# Altium schematic sheet Adapter.SchDoc
size B
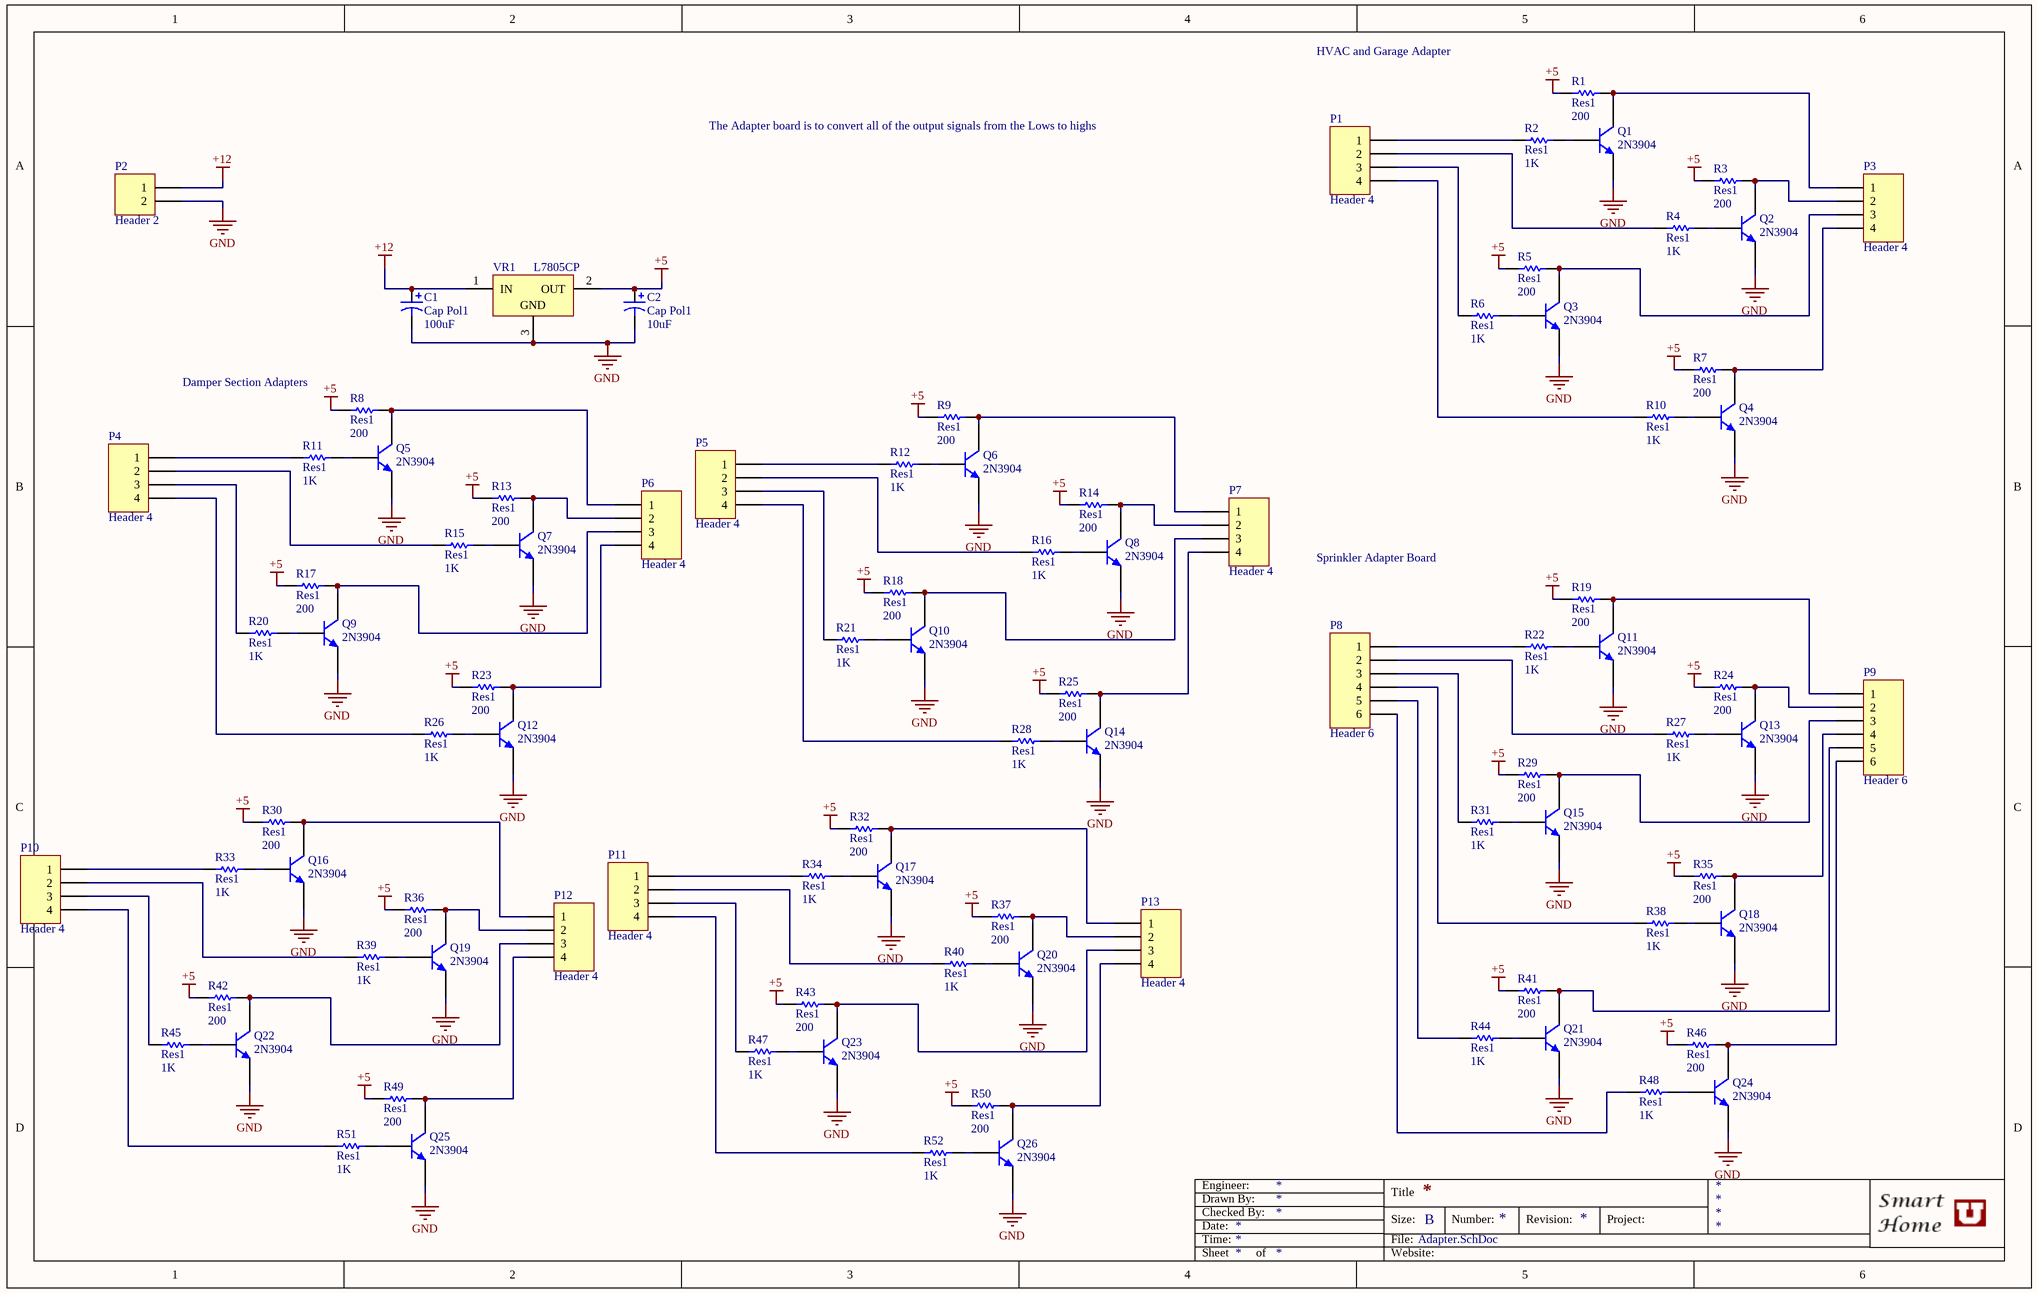
[diagram p0: Adapter.SchDoc]

## Parts
C1  Cap Pol1  value 100uF  [RB7.6-15]
C2  Cap Pol1  value 10uF  [RB7.6-15]
P1  Header 4  [HDR1X4]
P2  Header 2  [HDR1X2]
P3  Header 4  [HDR1X4]
P4  Header 4  [HDR1X4]
P5  Header 4  [HDR1X4]
P6  Header 4  [HDR1X4]
P7  Header 4  [HDR1X4]
P8  Header 6  [HDR1X6]
P9  Header 6  [HDR1X6]
P10  Header 4  [HDR1X4]
P11  Header 4  [HDR1X4]
P12  Header 4  [HDR1X4]
P13  Header 4  [HDR1X4]
Q1  2N3904  [2N3904]
Q2  2N3904  [2N3904]
Q3  2N3904  [2N3904]
Q4  2N3904  [2N3904]
Q5  2N3904  [2N3904]
Q6  2N3904  [2N3904]
Q7  2N3904  [2N3904]
Q8  2N3904  [2N3904]
Q9  2N3904  [2N3904]
Q10  2N3904  [2N3904]
Q11  2N3904  [2N3904]
Q12  2N3904  [2N3904]
Q13  2N3904  [2N3904]
Q14  2N3904  [2N3904]
Q15  2N3904  [2N3904]
Q16  2N3904  [2N3904]
Q17  2N3904  [2N3904]
Q18  2N3904  [2N3904]
Q19  2N3904  [2N3904]
Q20  2N3904  [2N3904]
Q21  2N3904  [2N3904]
Q22  2N3904  [2N3904]
Q23  2N3904  [2N3904]
Q24  2N3904  [2N3904]
Q25  2N3904  [2N3904]
Q26  2N3904  [2N3904]
R1  Res1  value 200  [AXIAL-0.3]
R2  Res1  value 1K  [AXIAL-0.3]
R3  Res1  value 200  [AXIAL-0.3]
R4  Res1  value 1K  [AXIAL-0.3]
R5  Res1  value 200  [AXIAL-0.3]
R6  Res1  value 1K  [AXIAL-0.3]
R7  Res1  value 200  [AXIAL-0.3]
R8  Res1  value 200  [AXIAL-0.3]
R9  Res1  value 200  [AXIAL-0.3]
R10  Res1  value 1K  [AXIAL-0.3]
R11  Res1  value 1K  [AXIAL-0.3]
R12  Res1  value 1K  [AXIAL-0.3]
R13  Res1  value 200  [AXIAL-0.3]
R14  Res1  value 200  [AXIAL-0.3]
R15  Res1  value 1K  [AXIAL-0.3]
R16  Res1  value 1K  [AXIAL-0.3]
R17  Res1  value 200  [AXIAL-0.3]
R18  Res1  value 200  [AXIAL-0.3]
R19  Res1  value 200  [AXIAL-0.3]
R20  Res1  value 1K  [AXIAL-0.3]
R21  Res1  value 1K  [AXIAL-0.3]
R22  Res1  value 1K  [AXIAL-0.3]
R23  Res1  value 200  [AXIAL-0.3]
R24  Res1  value 200  [AXIAL-0.3]
R25  Res1  value 200  [AXIAL-0.3]
R26  Res1  value 1K  [AXIAL-0.3]
R27  Res1  value 1K  [AXIAL-0.3]
R28  Res1  value 1K  [AXIAL-0.3]
R29  Res1  value 200  [AXIAL-0.3]
R30  Res1  value 200  [AXIAL-0.3]
R31  Res1  value 1K  [AXIAL-0.3]
R32  Res1  value 200  [AXIAL-0.3]
R33  Res1  value 1K  [AXIAL-0.3]
R34  Res1  value 1K  [AXIAL-0.3]
R35  Res1  value 200  [AXIAL-0.3]
R36  Res1  value 200  [AXIAL-0.3]
R37  Res1  value 200  [AXIAL-0.3]
R38  Res1  value 1K  [AXIAL-0.3]
R39  Res1  value 1K  [AXIAL-0.3]
R40  Res1  value 1K  [AXIAL-0.3]
R41  Res1  value 200  [AXIAL-0.3]
R42  Res1  value 200  [AXIAL-0.3]
R43  Res1  value 200  [AXIAL-0.3]
R44  Res1  value 1K  [AXIAL-0.3]
R45  Res1  value 1K  [AXIAL-0.3]
R46  Res1  value 200  [AXIAL-0.3]
R47  Res1  value 1K  [AXIAL-0.3]
R48  Res1  value 1K  [AXIAL-0.3]
R49  Res1  value 200  [AXIAL-0.3]
R50  Res1  value 200  [AXIAL-0.3]
R51  Res1  value 1K  [AXIAL-0.3]
R52  Res1  value 1K  [AXIAL-0.3]
VR1  L7805CP  [ISOWATT220AB]

## Nets
+5: C2.1 R1.1 R3.1 R5.1 R7.1 R8.1 R9.1 R13.1 R14.1 R17.1 R18.1 R19.1 R23.1 R24.1 R25.1 R29.1 R30.1 R32.1 R35.1 R36.1 R37.1 R41.1 R42.1 R43.1 R46.1 R49.1 R50.1 VR1.2(OUT)
+12: C1.1 P2.1 VR1.1(IN)
GND: C1.2 C2.2 P2.2 Q1.1(E) Q2.1(E) Q3.1(E) Q4.1(E) Q5.1(E) Q6.1(E) Q7.1(E) Q8.1(E) Q9.1(E) Q10.1(E) Q11.1(E) Q12.1(E) Q13.1(E) Q14.1(E) Q15.1(E) Q16.1(E) Q17.1(E) Q18.1(E) Q19.1(E) Q20.1(E) Q21.1(E) Q22.1(E) Q23.1(E) Q24.1(E) Q25.1(E) Q26.1(E) VR1.3(GND)
NetP1_1: P1.1 R2.1
NetP1_2: P1.2 R4.1
NetP1_3: P1.3 R6.1
NetP1_4: P1.4 R10.1
NetP3_1: P3.1 Q1.3(C) R1.2
NetP3_2: P3.2 Q2.3(C) R3.2
NetP3_3: P3.3 Q3.3(C) R5.2
NetP3_4: P3.4 Q4.3(C) R7.2
NetP4_1: P4.1 R11.1
NetP4_2: P4.2 R15.1
NetP4_3: P4.3 R20.1
NetP4_4: P4.4 R26.1
NetP5_1: P5.1 R12.1
NetP5_2: P5.2 R16.1
NetP5_3: P5.3 R21.1
NetP5_4: P5.4 R28.1
NetP6_1: P6.1 Q5.3(C) R8.2
NetP6_2: P6.2 Q7.3(C) R13.2
NetP6_3: P6.3 Q9.3(C) R17.2
NetP6_4: P6.4 Q12.3(C) R23.2
NetP7_1: P7.1 Q6.3(C) R9.2
NetP7_2: P7.2 Q8.3(C) R14.2
NetP7_3: P7.3 Q10.3(C) R18.2
NetP7_4: P7.4 Q14.3(C) R25.2
NetP8_1: P8.1 R22.1
NetP8_2: P8.2 R27.1
NetP8_3: P8.3 R31.1
NetP8_4: P8.4 R38.1
NetP8_5: P8.5 R44.1
NetP8_6: P8.6 R48.1
NetP9_1: P9.1 Q11.3(C) R19.2
NetP9_2: P9.2 Q13.3(C) R24.2
NetP9_3: P9.3 Q15.3(C) R29.2
NetP9_4: P9.4 Q18.3(C) R35.2
NetP9_5: P9.5 Q21.3(C) R41.2
NetP9_6: P9.6 Q24.3(C) R46.2
NetP10_1: P10.1 R33.1
NetP10_2: P10.2 R39.1
NetP10_3: P10.3 R45.1
NetP10_4: P10.4 R51.1
NetP11_1: P11.1 R34.1
NetP11_2: P11.2 R40.1
NetP11_3: P11.3 R47.1
NetP11_4: P11.4 R52.1
NetP12_1: P12.1 Q16.3(C) R30.2
NetP12_2: P12.2 Q19.3(C) R36.2
NetP12_3: P12.3 Q22.3(C) R42.2
NetP12_4: P12.4 Q25.3(C) R49.2
NetP13_1: P13.1 Q17.3(C) R32.2
NetP13_2: P13.2 Q20.3(C) R37.2
NetP13_3: P13.3 Q23.3(C) R43.2
NetP13_4: P13.4 Q26.3(C) R50.2
NetQ1_2: Q1.2(B) R2.2
NetQ2_2: Q2.2(B) R4.2
NetQ3_2: Q3.2(B) R6.2
NetQ4_2: Q4.2(B) R10.2
NetQ5_2: Q5.2(B) R11.2
NetQ6_2: Q6.2(B) R12.2
NetQ7_2: Q7.2(B) R15.2
NetQ8_2: Q8.2(B) R16.2
NetQ9_2: Q9.2(B) R20.2
NetQ10_2: Q10.2(B) R21.2
NetQ11_2: Q11.2(B) R22.2
NetQ12_2: Q12.2(B) R26.2
NetQ13_2: Q13.2(B) R27.2
NetQ14_2: Q14.2(B) R28.2
NetQ15_2: Q15.2(B) R31.2
NetQ16_2: Q16.2(B) R33.2
NetQ17_2: Q17.2(B) R34.2
NetQ18_2: Q18.2(B) R38.2
NetQ19_2: Q19.2(B) R39.2
NetQ20_2: Q20.2(B) R40.2
NetQ21_2: Q21.2(B) R44.2
NetQ22_2: Q22.2(B) R45.2
NetQ23_2: Q23.2(B) R47.2
NetQ24_2: Q24.2(B) R48.2
NetQ25_2: Q25.2(B) R51.2
NetQ26_2: Q26.2(B) R52.2

## Notes on the sheet
- HVAC and Garage Adapter
- The Adapter board is to convert all of the output signals from the Lows to highs
- (near R8) Damper Section Adapters
- Sprinkler Adapter Board
- Date:
- Time:
- Engineer:
- Drawn By:
- Checked By:
- Title
- Size:
- File:
- B
- Number:
- Revision:
- Project:
- Sheet
- of
- Website:

## Library data of the parts
C1 C2 = Cap Pol1: Polarized Capacitor (Radial); Published: 8-Jun-2000; LatestRevisionDate: 17-Jul-2002; LatestRevisionNote: Re-released for DXP Platform.; PackageReference: RB7.6-15; Publisher: Altium Limited; PackageDescription: Polarized Capacitor (Radial); 2 Leads
P1 P3-P7 P10-P13 = Header 4: Header, 4-Pin; LatestRevisionDate: 17-Jul-2002; LatestRevisionNote: Re-released for DXP Platform.; Publisher: Altium Limited
P2 = Header 2: Header, 2-Pin; LatestRevisionDate: 17-Jul-2002; LatestRevisionNote: Re-released for DXP Platform.; Publisher: Altium Limited
P8 P9 = Header 6: Header, 6-Pin; LatestRevisionDate: 17-Jul-2002; LatestRevisionNote: Re-released for DXP Platform.; Publisher: Altium Limited
Q1-Q26 = 2N3904: NPN General Purpose Amplifier; Published: 8-Jun-2000; LatestRevisionDate: 15-Jan-2003; LatestRevisionNote: PCB Footprint 'BCY-W3/D4.7' replaced; DatasheetVersion: 1997; PackageVersion: Sep-1998; PackageReference: TO-92A; Publisher: Altium Limited; PackageDescription: TO, Flat Index; 3 In-Line, Axial Leads; Body Dia. 4.5mm; Leads 0.51 x 0.48 mm (max); ComponentLink1Description: Manufacturer Link; ComponentLink1URL: http://www.fairchildsemi.com/; ComponentLink2Description: Datasheet; ComponentLink2URL: http://www.fairchildsemi.com/ds/2N%2F2N3904.pdf
R1-R52 = Res1: Resistor; Published: 8-Jun-2000; LatestRevisionDate: 17-Jul-2002; LatestRevisionNote: Re-released for DXP Platform.; PackageReference: AXIAL-0.3; Publisher: Altium Limited; PackageDescription: Axial Device, Thru-Hole; 2 Leads; 0.3 in Pin Spacing
VR1 = L7805CP: Positive Voltage Regulator; Note: Tab is connected to pin 3 (GND).; Vendor: Taydaelectronics; Published: 24-Aug-2001; LatestRevisionDate: 17-Jul-2002; LatestRevisionNote: Re-released for DXP Platform.; DatasheetVersion: Dec-1998; PackageVersion: Jul-1998; PackageReference: ISOWATT220AB; Publisher: Altium Limited; PackageDescription: TO, Thru-Hole, Vertical, Heatsink Mounted; 3 In-Line Leads; Pitch 2.54 mm; Pin sequence 1, 3, 2; ComponentLink1URL: http://www.st.com/; Price: 0.24; Value: L7805CP